# Altium project WSN_v1.1.PrjPcb
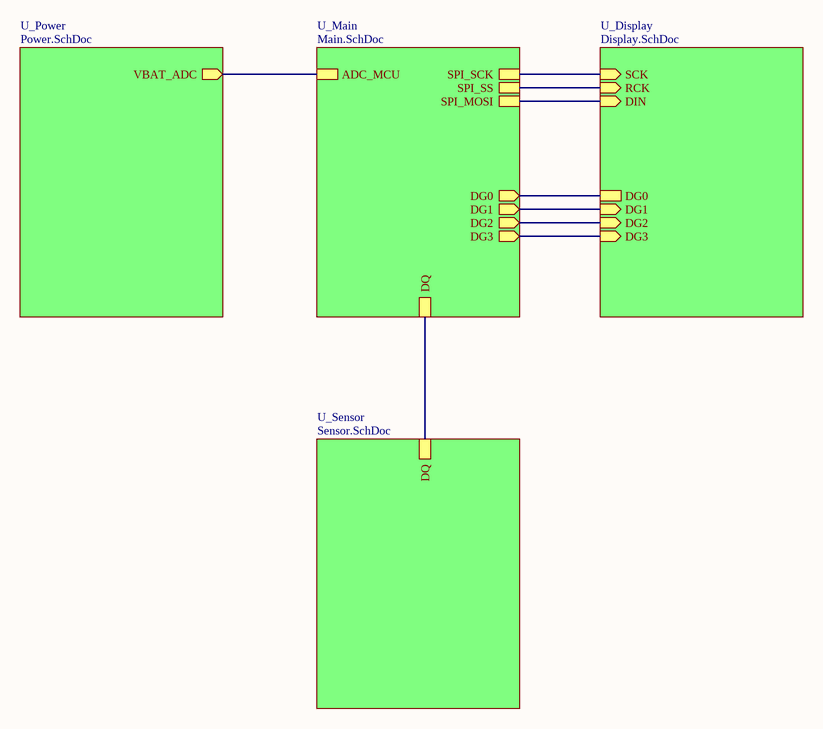
[diagram p0: CONN.SchDoc]
5 sheets, 63 parts. Net scope: hierarchical (ports join the sheet entries above them; power ports are global).
Board file: WSN_v1.1.PcbDoc
Sheets:
  CONN.SchDoc
    U_Display = Display.SchDoc
    U_Power = Power.SchDoc
    U_Main = Main.SchDoc
    U_Sensor = Sensor.SchDoc

## Sheet CONN.SchDoc
size A3; SheetNumber: 1; SheetTotal: 5

### Sub-sheets
U_Display = Display.SchDoc: DIN (in), RCK (in), SCK (in), DG0, DG1 (in), DG2 (in), DG3 (in)
U_Main = Main.SchDoc: DQ, DG0 (out), DG1 (out), DG2 (out), DG3 (out), ADC_MCU, SPI_SCK, SPI_MOSI, SPI_SS
U_Power = Power.SchDoc: VBAT_ADC (out)
U_Sensor = Sensor.SchDoc: DQ

### Nets
DG0: sheet U_Display/DG0, sheet U_Main/DG0
DG1: sheet U_Display/DG1, sheet U_Main/DG1
DG2: sheet U_Display/DG2, sheet U_Main/DG2
DG3: sheet U_Display/DG3, sheet U_Main/DG3
NetC12_2: sheet U_Power/VBAT_ADC, sheet U_Main/ADC_MCU
NetIC6_2: sheet U_Main/DQ, sheet U_Sensor/DQ
NetU1_11: sheet U_Display/SCK, sheet U_Main/SPI_SCK
NetU1_12: sheet U_Display/RCK, sheet U_Main/SPI_SS
NetU1_14: sheet U_Display/DIN, sheet U_Main/SPI_MOSI

## Sheet Display.SchDoc
size A; SheetNumber: 2; SheetTotal: 5
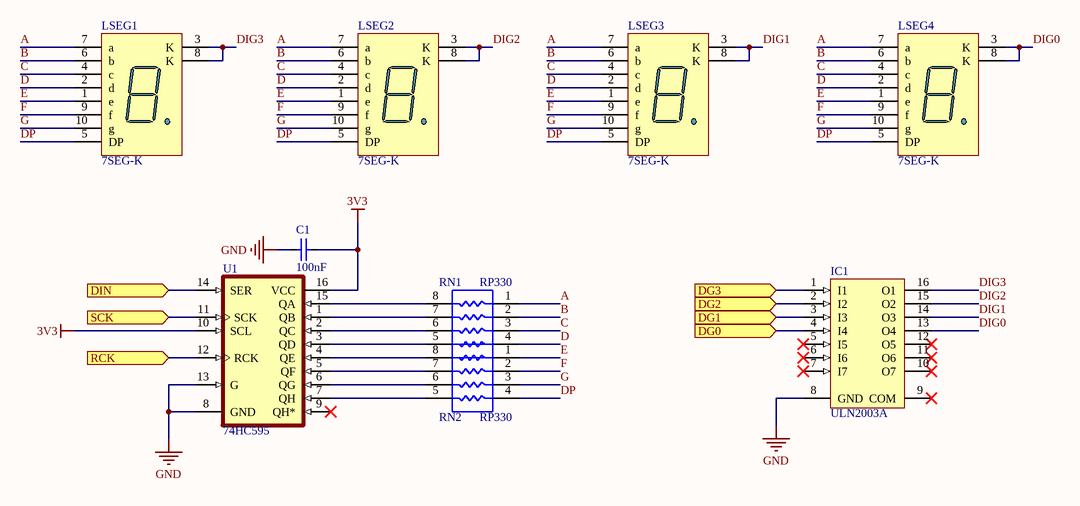
[diagram p1: Display.SchDoc]

### Parts
C1  100nF  [CAP_0805]
IC1  ULN2003A  [SOIC16]
LSEG1  7SEG-K  [LED7SEG]
LSEG2  7SEG-K  [LED7SEG]
LSEG3  7SEG-K  [LED7SEG]
LSEG4  7SEG-K  [LED7SEG]
RN1  RP330  [RN4-0805]
RN2  RP330  [RN4-0805]
U1  74HC595  [SOIC16]

### Ports
DG0 (in), DG1 (in), DG2 (in), DG3 (in), DIN (in), RCK (in), SCK (in)

### Nets
3V3: C1.1 U1.10(SCL) U1.16(VCC)
GND: C1.2 IC1.8(GND) U1.8(GND) U1.13(G)
A: LSEG1.7(a) LSEG2.7(a) LSEG3.7(a) LSEG4.7(a) RN1.1
B: LSEG1.6(b) LSEG2.6(b) LSEG3.6(b) LSEG4.6(b) RN1.2
C: LSEG1.4(c) LSEG2.4(c) LSEG3.4(c) LSEG4.4(c) RN1.3
D: LSEG1.2(d) LSEG2.2(d) LSEG3.2(d) LSEG4.2(d) RN1.4
DG0: IC1.4(I4) ; port DG0
DG1: IC1.3(I3) ; port DG1
DG2: IC1.2(I2) ; port DG2
DG3: IC1.1(I1) ; port DG3
DIG0: IC1.13(O4) LSEG4.3(K) LSEG4.8(K)
DIG1: IC1.14(O3) LSEG3.3(K) LSEG3.8(K)
DIG2: IC1.15(O2) LSEG2.3(K) LSEG2.8(K)
DIG3: IC1.16(O1) LSEG1.3(K) LSEG1.8(K)
DP: LSEG1.5(DP) LSEG2.5(DP) LSEG3.5(DP) LSEG4.5(DP) RN2.4
E: LSEG1.1(e) LSEG2.1(e) LSEG3.1(e) LSEG4.1(e) RN2.1
F: LSEG1.9(f) LSEG2.9(f) LSEG3.9(f) LSEG4.9(f) RN2.2
G: LSEG1.10(g) LSEG2.10(g) LSEG3.10(g) LSEG4.10(g) RN2.3
NetRN1_5: RN1.5 U1.3(QD)
NetRN1_6: RN1.6 U1.2(QC)
NetRN1_7: RN1.7 U1.1(QB)
NetRN1_8: RN1.8 U1.15(QA)
NetRN2_5: RN2.5 U1.7(QH)
NetRN2_6: RN2.6 U1.6(QG)
NetRN2_7: RN2.7 U1.5(QF)
NetRN2_8: RN2.8 U1.4(QE)
NetU1_11: U1.11(SCK) ; port SCK
NetU1_12: U1.12(RCK) ; port RCK
NetU1_14: U1.14(SER) ; port DIN

Not connected (* = marked no-connect by the designer): IC1 5(I5)* 6(I6)* 7(I7)* 9(COM)* 10(O7)* 11(O6)* 12(O5)*; U1 9(QH*)*

### Library data of the parts
C1 = CapSMD: Capacitor; Value: 33p; Published: 8-Jun-2000; LatestRevisionDate: 17-Jul-2002; LatestRevisionNote: Re-released for DXP Platform.; PackageReference: RAD-0.3; Publisher: Altium Limited
IC1 = ULN2003A: High-Voltage, High-Current Darlington Array; LatestRevisionNote: Stylized 3D Model Added.; Publisher: Altium Limited; Value: ULN2003A
LSEG1-LSEG4 = LED7SEG-K: 14.2 mm General Purpose Blue 7-Segment Display: CC, RH DP, Gray Surface; MinimumIntensity: 2020 ucd; Note: IF = 10 mA; Published: 8-Jun-2000; LatestRevisionDate: 17-Dec-2003; LatestRevisionNote: Schematic revised, PCB Footprint replaced.; DatasheetDocument: 24-Sep-2002; PackageDocument: 24-Sep-2002; PackageReference: H; Publisher: Altium Limited; Colour: Blue; ComponentLink1Description: Manufacturer Link; ComponentLink1URL: http://www.agilent.com/
RN1 RN2 = RN4-Dual
U1 = 74HC595: 8-bit Serial-Input/Serial or Parallel Output Shift Register with Latched 3-state Outputs

## Sheet Power.SchDoc
size A3; SheetNumber: 4; SheetTotal: 5
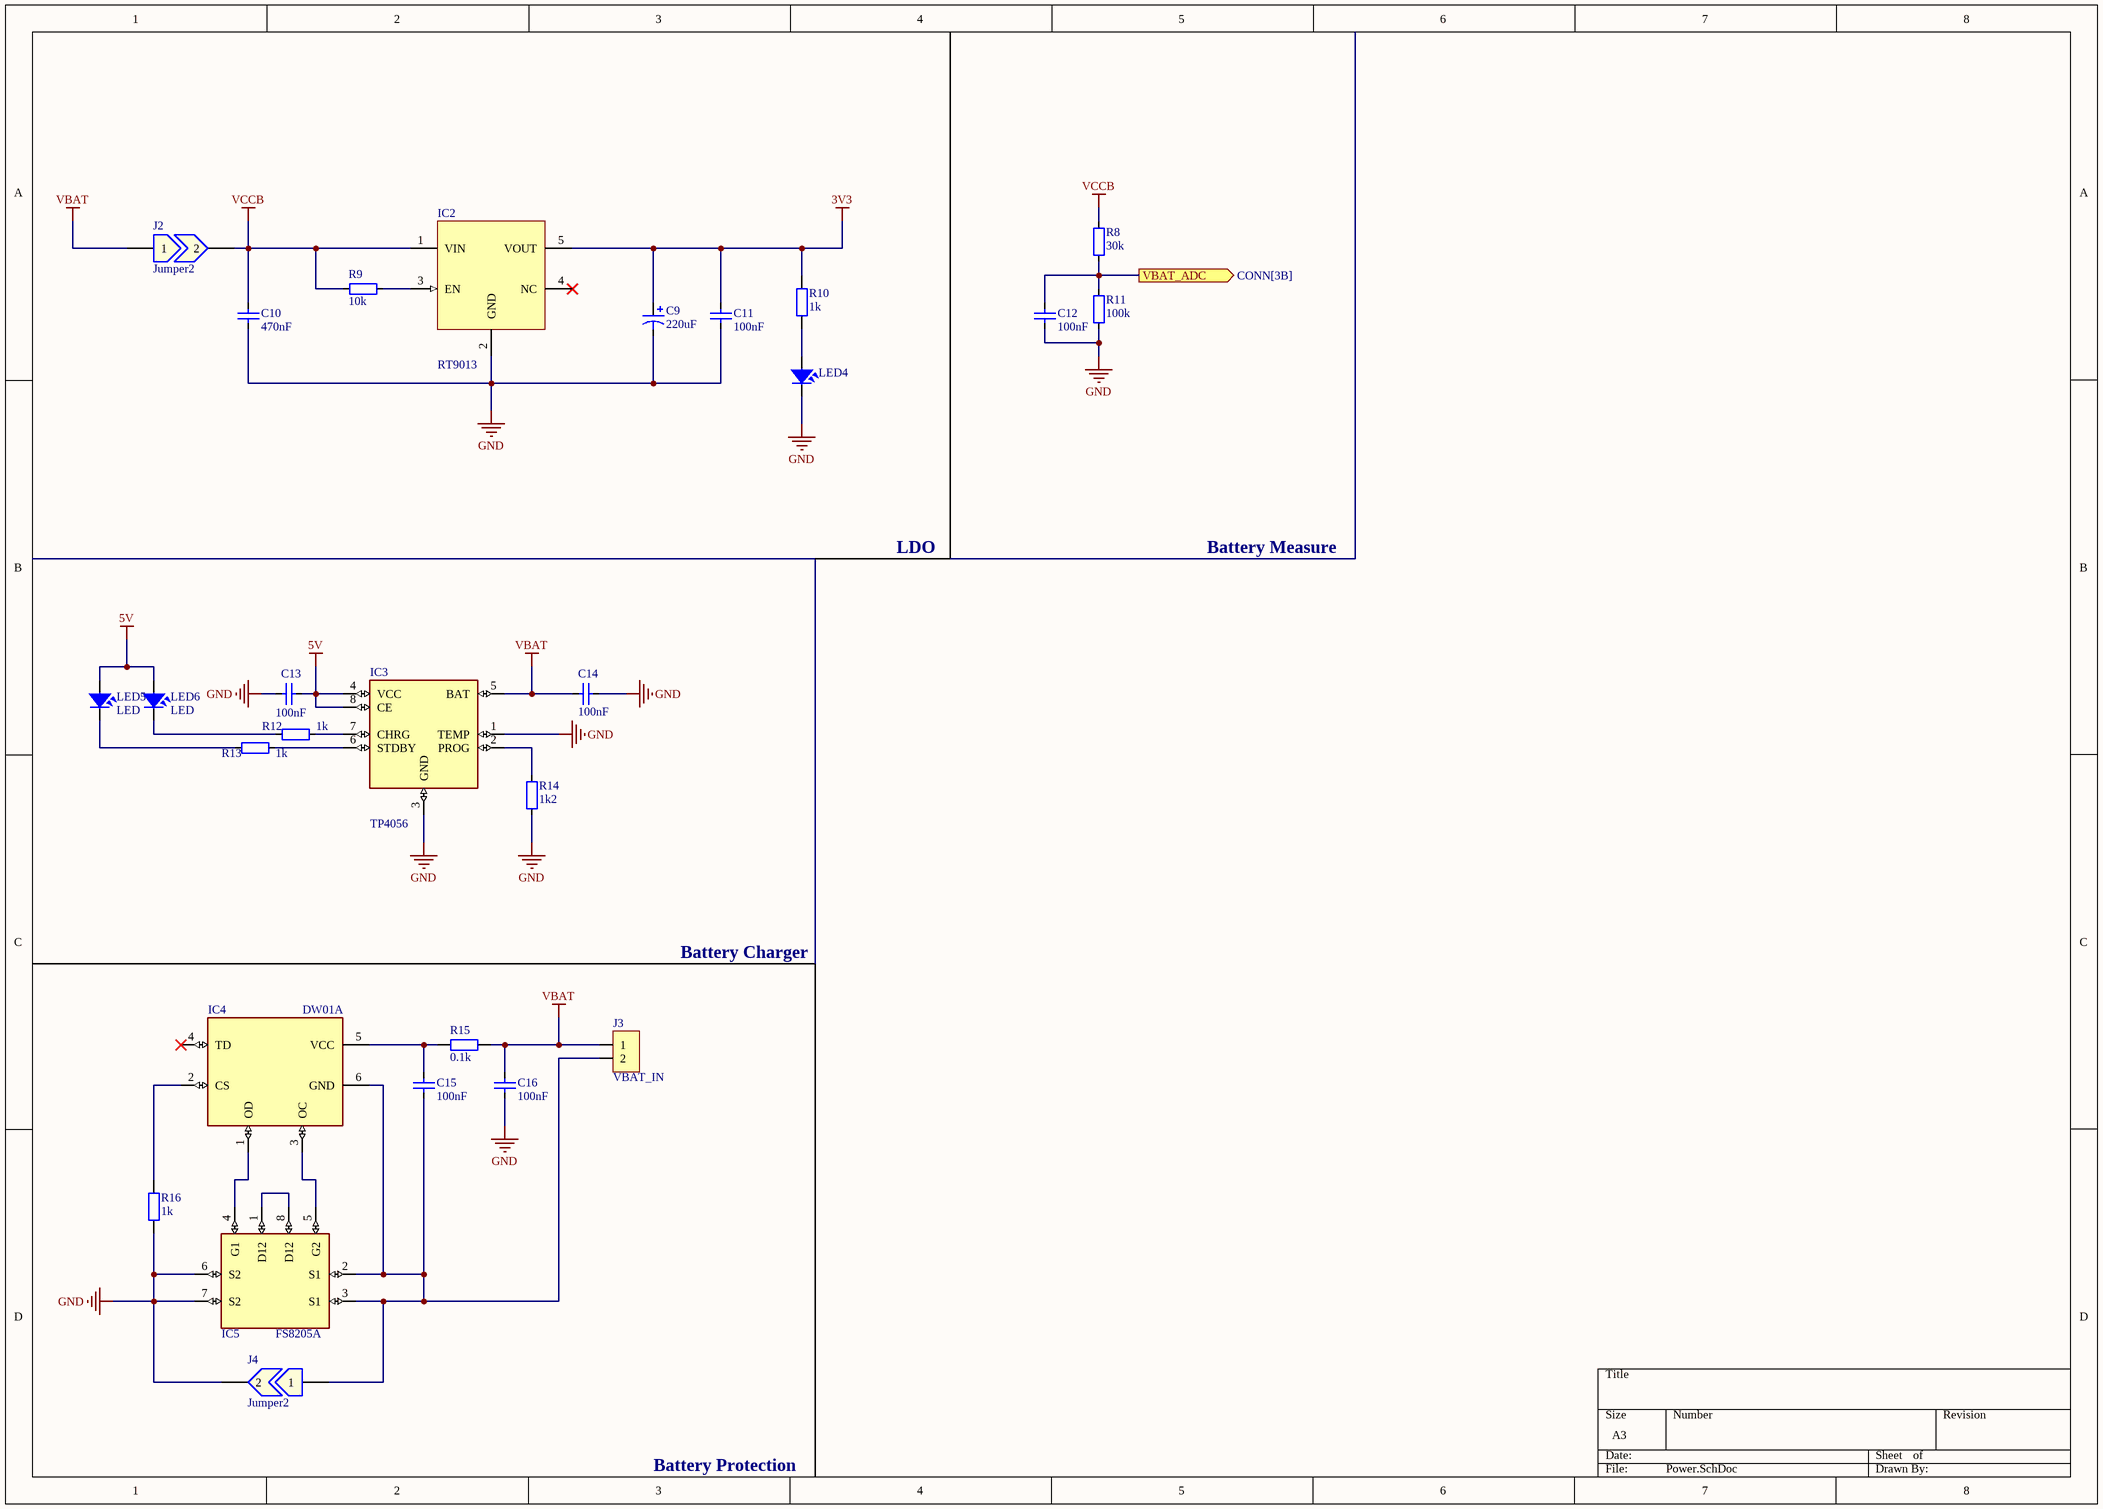
[diagram p2: Power.SchDoc]

### Parts
C9  220uF  [CAP_TANTALUM_3216]
C10  470nF  [CAP_0805]
C11  100nF  [CAP_0805]
C12  100nF  [CAP_0805]
C13  100nF  [CAP_0805]
C14  100nF  [CAP_0805]
C15  100nF  [CAP_0805]
C16  100nF  [CAP_0805]
IC2  RT9013  [SOT23-5]
IC3  TP4056  [TP4056]
IC4  DW01A  [SOT23-6]
IC5  FS8205A  [FS8205A]
J2  Jumper2  [JUMPER2]
J3  VBAT_IN  [JP2-D1T]
J4  Jumper2  [RES-SMD-0201]
LED4  (no value)  [LED-0805-Red]
LED5  LED  [LED-0805-Red]
LED6  LED  [LED-0805-Green]
R8  30k  [RES-SMD-0805]
R9  10k  [RES-SMD-0805]
R10  1k  [RES-SMD-0805]
R11  100k  [RES-SMD-0805]
R12  1k  [RES-SMD-0805]
R13  1k  [RES-SMD-0805]
R14  1k2  [RES-SMD-0805]
R15  0.1k  [RES-SMD-0805]
R16  1k  [RES-SMD-0805]

### Ports
VBAT_ADC (out, see CONN[3B])

### Nets
3V3: C9.1 C11.1 IC2.5(VOUT) R10.2
5V: C13.1 IC3.4(VCC) IC3.8(CE) LED5.1 LED6.1
GND: C9.2 C10.2 C11.2 C12.1 C13.2 C14.1 C16.1 IC2.2(GND) IC3.1(TEMP) IC3.3(GND) IC5.6(S2) IC5.7(S2) J4.2 LED4.2 R11.2 R14.1 R16.2
VBAT: C14.2 C16.2 IC3.5(BAT) J2.1 J3.1 R15.2
VCCB: C10.1 IC2.1(VIN) J2.2 R8.1 R9.2
NetC12_2: C12.2 R8.2 R11.1 ; port VBAT_ADC
NetC15_1: C15.1 IC4.6(GND) IC5.2(S1) IC5.3(S1) J3.2 J4.1
NetC15_2: C15.2 IC4.5(VCC) R15.1
NetIC2_3: IC2.3(EN) R9.1
NetIC3_2: IC3.2(PROG) R14.2
NetIC3_6: IC3.6(STDBY) R13.1
NetIC3_7: IC3.7(CHRG) R12.1
NetIC4_1: IC4.1(OD) IC5.4(G1)
NetIC4_2: IC4.2(CS) R16.1
NetIC4_3: IC4.3(OC) IC5.5(G2)
NetIC5_1: IC5.1(D12) IC5.8(D12)
NetLED4_1: LED4.1 R10.1
NetLED5_2: LED5.2 R13.2
NetLED6_2: LED6.2 R12.2

Not connected (* = marked no-connect by the designer): IC2 4(NC)*; IC4 4(TD)*

### Notes on the sheet
- LDO
- Battery Measure
- Battery Charger
- Battery Protection

### Library data of the parts
C9 = Cap Pol: Polarized Capacitor (Axial); Published: 8-Jun-2000; LatestRevisionDate: 17-Jul-2002; LatestRevisionNote: Re-released for DXP Platform.; PackageReference: POLAR0.8; Publisher: Altium Limited
C10-C16 = CapSMD: Capacitor; Value: 33p; Published: 8-Jun-2000; LatestRevisionDate: 17-Jul-2002; LatestRevisionNote: Re-released for DXP Platform.; PackageReference: RAD-0.3; Publisher: Altium Limited
IC2 = RT9013: https://linhkien.cxt.vn/5435-rt9013-33gb-ic-reg-linear-33v-500ma-sot23-5.html
IC3 = TP4056: Complete single cell Li-Ion battery with a constant current / constant voltage linear charger
IC4 = DW01A: One Cell Lithium-ion/Polymer Battery Protection IC
J2 J4 = Jumper2: Jumper, 2-Pin
J3 = JP2: WR-PHD 2.54 mm Angled Socket Header; Manufacturer: W¨¹rth Elektronik eiSos GmbH; partNo: 613002143121; ComponentLink1 Description: Manufacturer; ComponentLink2 Description: Datasheet; NoPins: 02; Created Date: 29 March 2013; ComponentLink1URL: http://www.we-online.com; ComponentLink2URL: http://katalog.we-online.de/em/datasheet/6130xx143121.pdf; Created by: Karrer Zheng
LED4-LED6 = LED: LED Single colour Green and Red; Value: LED 3 ly Single Colour
R8 R9 R11-R14 = Resistor - SMD: Resistor; Manufacturer: Generic Components; Class: Passive; Published: 08/06/2000; Publisher: Altium Hobart Technology Centre
R10 R15 R16 = Resistor - SMD: Resistor SMD; Manufacturer: Generic Components; Class: Passive; Published: 08/06/2000; Publisher: Altium Hobart Technology Centre

## Sheet Main.SchDoc
size A; SheetNumber: 3; SheetTotal: 5
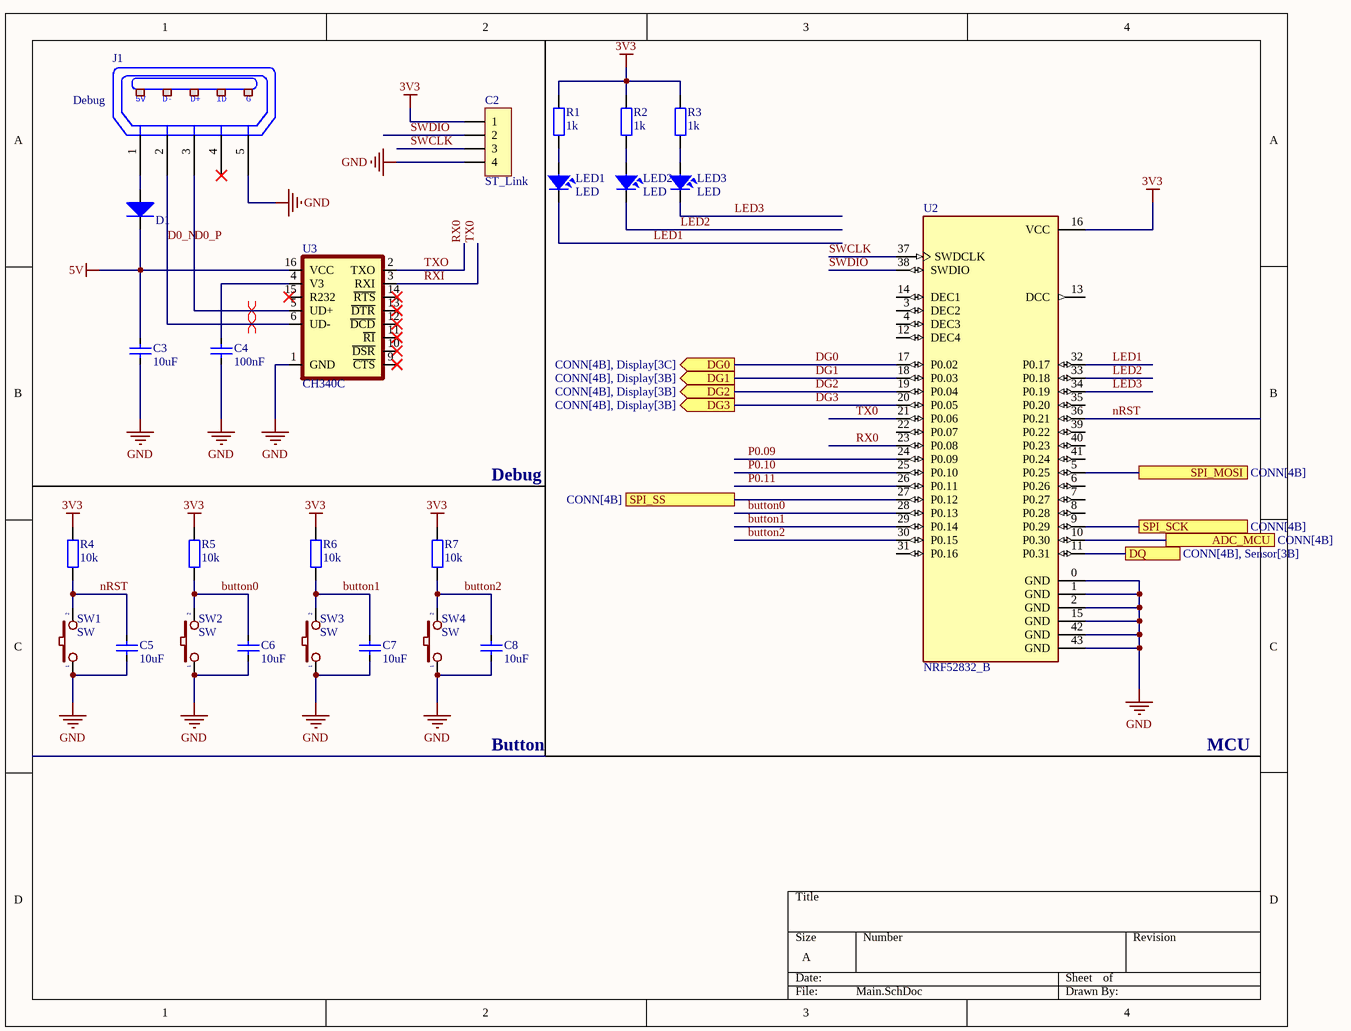
[diagram p3: Main.SchDoc]

### Parts
C2  ST_Link  [J4-D1T]
C3  10uF  [CAP_0805]
C4  100nF  [CAP_0805]
C5  10uF  [CAP_0805]
C6  10uF  [CAP_0805]
C7  10uF  [CAP_0805]
C8  10uF  [CAP_0805]
D1  Diode SMD  [DIO-214AC(SMA)]  (value not drawn)
J1  Debug  [USB-M1]
LED1  LED  [LED-0805-Red]
LED2  LED  [LED-0805-Yellow]
LED3  LED  [LED-0805-Green]
R1  1k  [RES-SMD-0805]
R2  1k  [RES-SMD-0805]
R3  1k  [RES-SMD-0805]
R4  10k  [RES-SMD-0805]
R5  10k  [RES-SMD-0805]
R6  10k  [RES-SMD-0805]
R7  10k  [RES-SMD-0805]
SW1  SW  [SW 3x2x4]
SW2  SW  [SW2]
SW3  SW  [SW2]
SW4  SW  [SW2]
U2  NRF52832_B  [NRF52832_B]
U3  CH340C  [SOP-16]

### Ports
ADC_MCU (see CONN[4B]), DG0 (out, see CONN[4B], Display[3C]), DG1 (out, see CONN[4B], Display[3B]), DG2 (out, see CONN[4B], Display[3B]), DG3 (out, see CONN[4B], Display[3B]), DQ (see CONN[4B], Sensor[3B]), SPI_MOSI (see CONN[4B]), SPI_SCK (see CONN[4B]), SPI_SS (see CONN[4B])

### Nets
3V3: C2.1 R1.1 R2.1 R3.1 R4.1 R5.1 R6.1 R7.1 U2.16(VCC)
5V: C3.2 D1.2(K) U3.16(VCC)
GND: C2.4 C3.1 C4.1 C5.1 C6.1 C7.1 C8.1 J1.5(P5) SW1.1 SW2.1 SW3.1 SW4.1 U2.0(GND) U2.1(GND) U2.2(GND) U2.15(GND) U2.42(GND) U2.43(GND) U3.1(GND)
button0: C6.2 R5.2 SW2.2 U2.28(P0.13)
button1: C7.2 R6.2 SW3.2 U2.29(P0.14)
button2: C8.2 R7.2 SW4.2 U2.30(P0.15)
D0_N: J1.2(P2) U3.6(UD-)
D0_P: J1.3(P3) U3.5(UD+)
DG0: U2.17(P0.02) ; port DG0
DG1: U2.18(P0.03) ; port DG1
DG2: U2.19(P0.04) ; port DG2
DG3: U2.20(P0.05) ; port DG3
LED1: LED1.2 U2.32(P0.17)
LED2: LED2.2 U2.33(P0.18)
LED3: LED3.2 U2.34(P0.19)
nRST: C5.2 R4.2 SW1.2 U2.36(P0.21)
P0.09: U2.24(P0.09)
P0.10: U2.25(P0.10)
P0.11: U2.26(P0.11)
RX0: U2.23(P0.08) U3.2(TXO)  [also labelled TXO]
RXI: U2.21(P0.06) U3.3(RXI)  [also labelled TX0]
SWCLK: C2.3 U2.37(SWDCLK)
SWDIO: C2.2 U2.38(SWDIO)
NetC4_2: C4.2 U3.4(V3)
NetC12_2: U2.10(P0.30) ; port ADC_MCU
NetD1_1: D1.1(A) J1.1(P1)
NetIC6_2: U2.11(P0.31) ; port DQ
NetLED1_1: LED1.1 R1.2
NetLED2_1: LED2.1 R2.2
NetLED3_1: LED3.1 R3.2
NetU1_11: U2.9(P0.29) ; port SPI_SCK
NetU1_12: U2.27(P0.12) ; port SPI_SS
NetU1_14: U2.5(P0.25) ; port SPI_MOSI

Not connected (* = marked no-connect by the designer): J1 4(P4)*; U2 3(DEC2) 4(DEC3) 6(P0.26) 7(P0.27) 8(P0.28) 12(DEC4) 13(DCC) 14(DEC1) 22(P0.07) 31(P0.16) 35(P0.20) 39(P0.22) 40(P0.23) 41(P0.24); U3 9(~{CTS})* 10(~{DSR})* 11(~{RI})* 12(~{DCD})* 13(~{DTR})* 14(~{RTS})* 15(R232)*

### Layout directives
differential pair: D0_N, D0_P

### Notes on the sheet
- Debug
- Button
- MCU
- (in symbol USB-5) 5V; D-; D+; ID; G

### Library data of the parts
C2 = JP4x1-2.0: WR-PHD 2.00 mm Socket Header; Manufacturer: W¨¹rth Elektronik eiSos GmbH; partNo: 62000411821; ComponentLink1 Description: Manufacturer; ComponentLink2 Description: Datasheet; NoPins: 04; Created Date: 2 April 2013; ComponentLink1URL: http://www.we-online.com; ComponentLink2URL: http://katalog.we-online.de/em/datasheet/6200xx11821.pdf; Created by: Karrer Zheng
C3-C8 = CapSMD: Capacitor; Value: 33p; Published: 8-Jun-2000; LatestRevisionDate: 17-Jul-2002; LatestRevisionNote: Re-released for DXP Platform.; PackageReference: RAD-0.3; Publisher: Altium Limited
D1 = Diode SMD: Default Diode; Code - JEDEC: DO-214-AB; Value: 1N5007; Published: 8-Jun-2000; Revision: July-2002: Re-released for DXP Platform.; Publisher: Altium Limited
J1 = USB-5: Manufacturer: FCI; Manufacturer Part Number: 10118193-0001LF; Connector Type: USB - micro B; Number of Contacts: 5; Gender: Receptacle; Specifications: USB 2.0; .Creator: MM; .Checked PCB: RF; Supplier 1: Digi-Key; RoHS: RoHS Compliant; Category: Connectors, Interconnects; Stock 1: 28642; Pricing 1: 1=0.46, 10=0.433, 25=0.3712, 50=0.3156, 100=0.3032, 250=0.27224, 500=0.25988 (USD); Packaging: Cut Tape (CT); Mounting Type: Surface Mount, Right Angle, Horizontal; Features: Shielded, Solder Retention; Ingress Protection: -; ComponentLink1URL: http://portal.fciconnect.com/Comergent//fci/drawing/10118193.pdf; ComponentLink1Description: http://portal.fciconnect.com/Comergent//fci/drawing/10118193.pdf; Supplier Part Number 1: 609-4616-1-ND; .Checked SCH: MM
LED1-LED3 = LED: as LED4 on sheet Power
R1-R7 = Resistor - SMD: as R10 on sheet Power; Published: 08/06/2000; Publisher: Altium Hobart Technology Centre
SW1-SW4 = SW2: Switch button 2 pin; Value: SW chip 2 pin
U2 = NRF52832_B: https://www.ebyte.com/product-view-news.aspx?id=239&=ds-tm
U3 = CH340C: USB to serial chip CH340; MF: WCH; Package: Package; Check_prices: https://www.snapeda.com/parts/CH340C/WCH/view-part/5428851/?ref=eda; Value: *; Price: None; MP: CH340C; Availability: Unavailable; SnapEDA_Link: https://www.snapeda.com/parts/CH340C/WCH/view-part/5428851/?ref=snap

## Sheet Sensor.SchDoc
size A; SheetNumber: 5; SheetTotal: 5
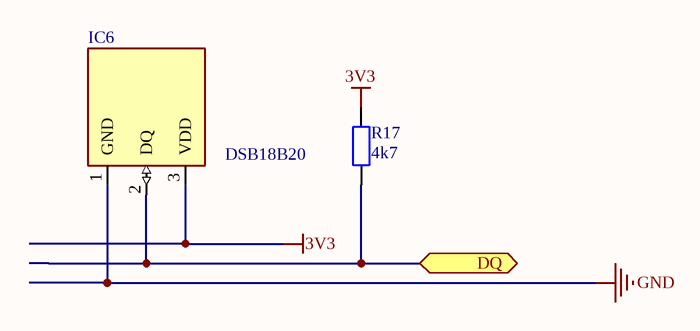
[diagram p4: Sensor.SchDoc]

### Parts
IC6  DSB18B20  [TO-92]
R17  4k7  [RES-SMD-0805]

### Ports
DQ (bidir)

### Nets
3V3: IC6.3(VDD) R17.2
GND: IC6.1(GND)
NetIC6_2: IC6.2(DQ) R17.1 ; port DQ

### Library data of the parts
IC6 = DSB18B20: https://linhkien.cxt.vn/3083-ds18b20-temperature-sensors-55-to-125-c-to-92-3.html
R17 = Resistor - SMD: as R10 on sheet Power; Published: 08/06/2000; Publisher: Altium Hobart Technology Centre

## Nets that join several sheets
3V3: Display (C1.1 U1.10 U1.16), Power (C9.1 C11.1 IC2.5 R10.2), Main (9 pins), Sensor (IC6.3 R17.2)
5V: Power (5 pins), Main (C3.2 D1.2 U3.16)
GND: Display (C1.2 IC1.8 U1.8 U1.13), Power (17 pins), Main (19 pins), Sensor (IC6.1)
DG0: Display (IC1.4), Main (U2.17)
DG1: Display (IC1.3), Main (U2.18)
DG2: Display (IC1.2), Main (U2.19)
DG3: Display (IC1.1), Main (U2.20)
NetC12_2: Power (C12.2 R8.2 R11.1), Main (U2.10)
NetIC6_2: Main (U2.11), Sensor (IC6.2 R17.1)
NetU1_11: Display (U1.11), Main (U2.9)
NetU1_12: Display (U1.12), Main (U2.27)
NetU1_14: Display (U1.14), Main (U2.5)